# EAGLE design sensor (EAGLE 5.10)
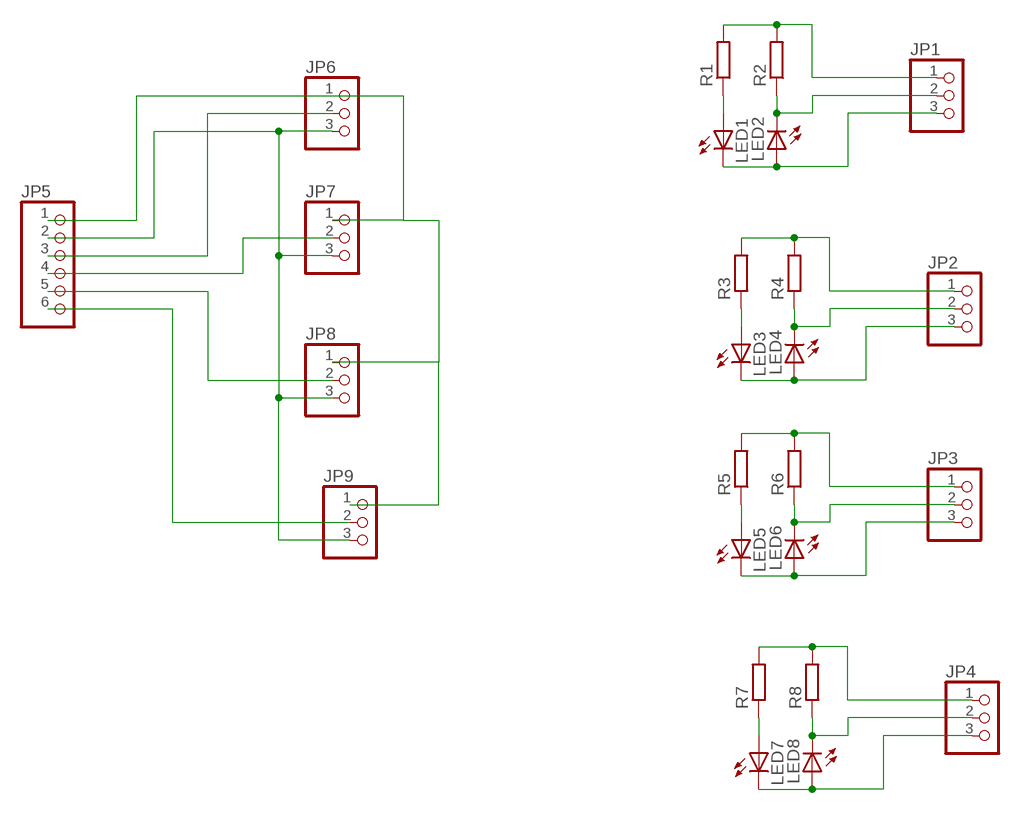
[diagram p0: schematic, sheet 1]

## Parts
JP1  PINHD-1X3  [1X03]
JP2  PINHD-1X3  [1X03]
JP3  PINHD-1X3  [1X03]
JP4  PINHD-1X3  [1X03]
JP5  PINHD-1X6  [1X06]
JP6  PINHD-1X3  [1X03]
JP7  PINHD-1X3  [1X03]
JP8  PINHD-1X3  [1X03]
JP9  PINHD-1X3  [1X03]
LED1  LED5MM  [LED5MM]
LED2  LED5MM  [LED5MM]
LED3  LED5MM  [LED5MM]
LED4  LED5MM  [LED5MM]
LED5  LED5MM  [LED5MM]
LED6  LED5MM  [LED5MM]
LED7  LED5MM  [LED5MM]
LED8  LED5MM  [LED5MM]
R1  R-EU_0204/7  [0204/7]
R2  R-EU_0204/7  [0204/7]
R3  R-EU_0204/7  [0204/7]
R4  R-EU_0204/7  [0204/7]
R5  R-EU_0204/7  [0204/7]
R6  R-EU_0204/7  [0204/7]
R7  R-EU_0204/7  [0204/7]
R8  R-EU_0204/7  [0204/7]

## Nets
N$1: JP1.1 R1.2 R2.2
N$2: JP1.3 LED1.K(C) LED2.A
N$3: JP1.2 LED2.K(C) R2.1
N$4: LED1.A R1.1
N$5: JP2.1 R3.2 R4.2
N$6: JP2.3 LED3.K(C) LED4.A
N$7: JP2.2 LED4.K(C) R4.1
N$8: LED3.A R3.1
N$9: JP3.1 R5.2 R6.2
N$10: JP3.3 LED5.K(C) LED6.A
N$11: JP3.2 LED6.K(C) R6.1
N$12: LED5.A R5.1
N$13: JP4.1 R7.2 R8.2
N$14: JP4.3 LED7.K(C) LED8.A
N$15: JP4.2 LED8.K(C) R8.1
N$16: LED7.A R7.1
N$17: JP5.1 JP6.1 JP7.1 JP8.1 JP9.1
N$19: JP5.2 JP6.3 JP7.3 JP8.3 JP9.3
N$22: JP5.3 JP6.2
N$23: JP5.4 JP7.2
N$24: JP5.5 JP8.2
N$25: JP5.6 JP9.2

## Library data of the parts
JP1-JP4 JP6-JP9 = pinhead:PINHD-1X3: PIN HEADER
JP5 = pinhead:PINHD-1X6: PIN HEADER
LED1-LED8 = led:LED: LED OSRAM: - CHIPLED LG R971, LG N971, LY N971, LG Q971, LY Q971, LO R971, LY R971 LH N974, LH R974 LS Q976, LO Q976, LY Q976 LO Q996 - Hyper CHIPLED LW Q18S LB Q993, LB Q99A, LB R99A - SideLED LS A670, LO A670, LY A670, LG A670, LP A670 LB A673, LV A673, LT A673, LW A673 LH A674 LY A675 LS A676, LA A676, LO A676, LY A676, LW A676 LS A679, LY A679, LG A679 - Hyper Micro SIDELED® LS Y876, LA Y876, LO Y876, LY Y876 LT Y87S - SmartLED LW L88C, LW L88S LB L89C, LB L89S, LG L890 LS L89K, LO L89K, LY L89K LS L896, LA L896, LO L896, LY L896 - TOPLED LS T670, LO T670, LY T670, LG T670, LP T670 LSG T670, LSP T670, LSY T670, LOP T670, LYG T670 LG T671, LOG T671, LSG T671 LB T673, LV T673, LT T673, LW T673 LH T674 LS T676, LA T676, LO T676, LY T676, LB T676, LH T676, LSB T676, LW T676 LB T67C, LV T67C, LT T67C, LS T67K, LO T67K, LY T67K, LW E67C LS E67B, LA E67B, LO E67B, LY E67B, LB E67C, LV E67C, LT E67C LW T67C LS T679, LY T679, LG T679 LS T770, LO T770, LY T770, LG T770, LP T770 LB T773, LV T773, LT T773, LW T773 LH T774 LS E675, LA E675, LY E675, LS T675 LS T776, LA T776, LO T776, LY T776, LB T776 LHGB T686 LT T68C, LB T68C - Hyper Mini TOPLED® LB M676 - Mini TOPLED Santana® LG M470 LS M47K, LO M47K, LY M47K Source: http://www.osram.convergy.de LUXEON: - LUMILED® LXK2-PW12-R00, LXK2-PW12-S00, LXK2-PW14-U00, LXK2-PW14-V00 LXK2-PM12-R00, LXK2-PM12-S00, LXK2-PM14-U00 LXK2-PE12-Q00, LXK2-PE12-R00, LXK2-PE12-S00, LXK2-PE14-T00, LXK2-PE14-U00 LXK2-PB12-K00, LXK2-PB12-L00, LXK2-PB12-M00, LXK2-PB14-N00, LXK2-PB14-P00, LXK2-PB14-Q00 LXK2-PR12-L00, LXK2-PR12-M00, LXK2-PR14-Q00, LXK2-PR14-R00 LXK2-PD12-Q00, LXK2-PD12-R00, LXK2-PD12-S00 LXK2-PH12-R00, LXK2-PH12-S00 LXK2-PL12-P00, LXK2-PL12-Q00, LXK2-PL12-R00 Source: www.luxeon.com KINGBRIGHT: KA-3528ASYC Source: www.kingbright.com
R1-R8 = rcl:R-EU_: RESISTOR, European symbol

## Board
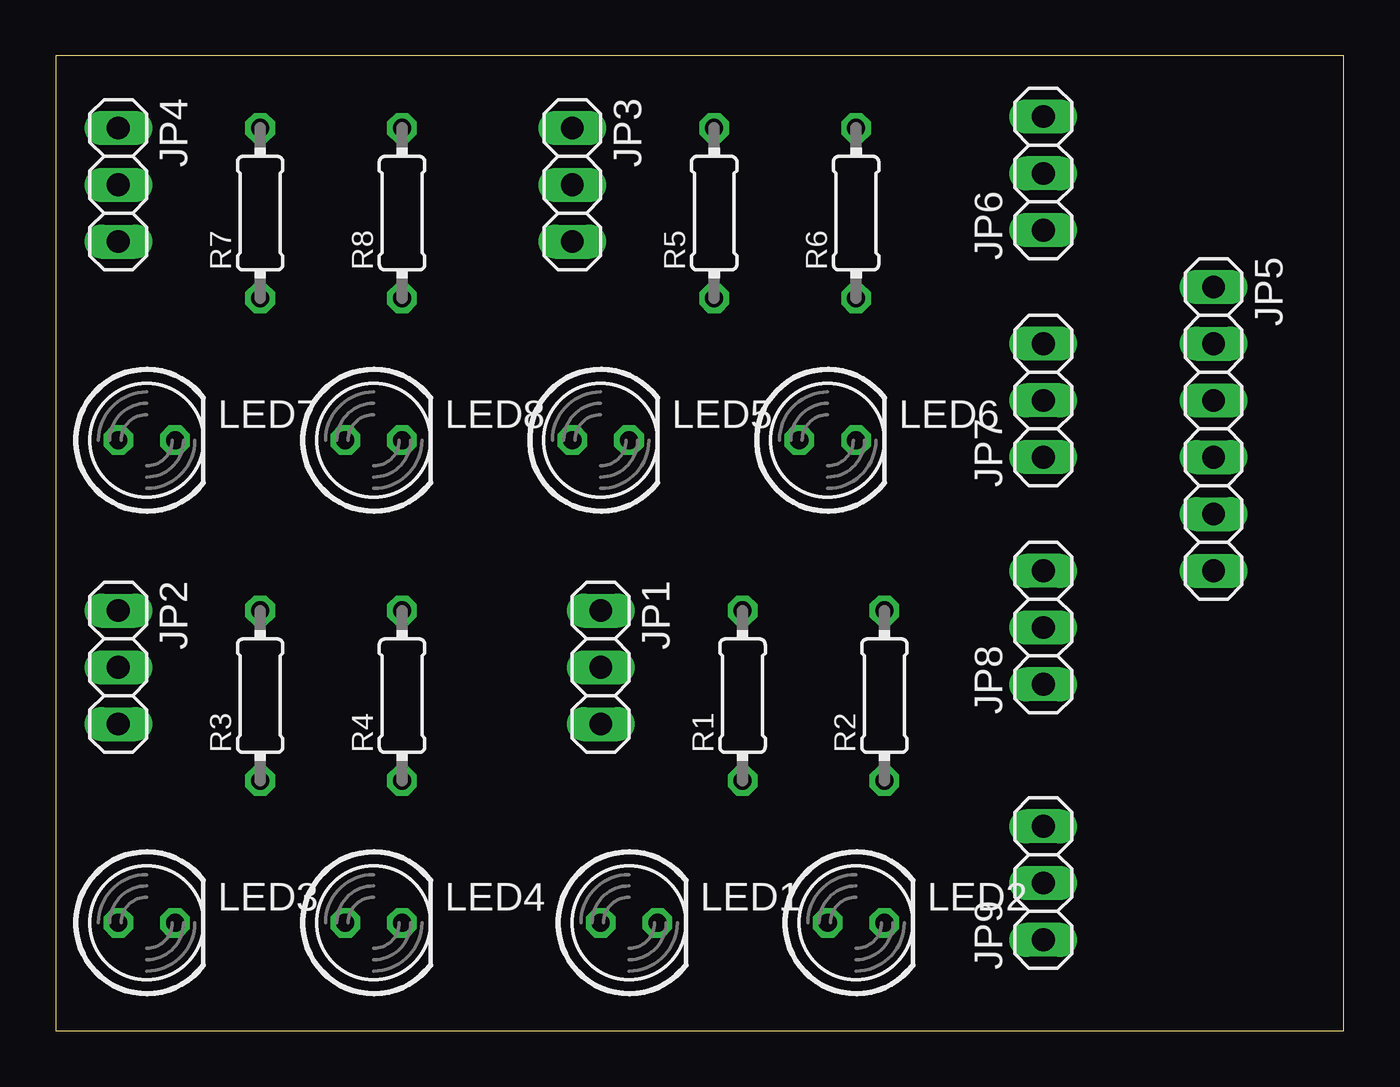
[diagram p1: board, top side]
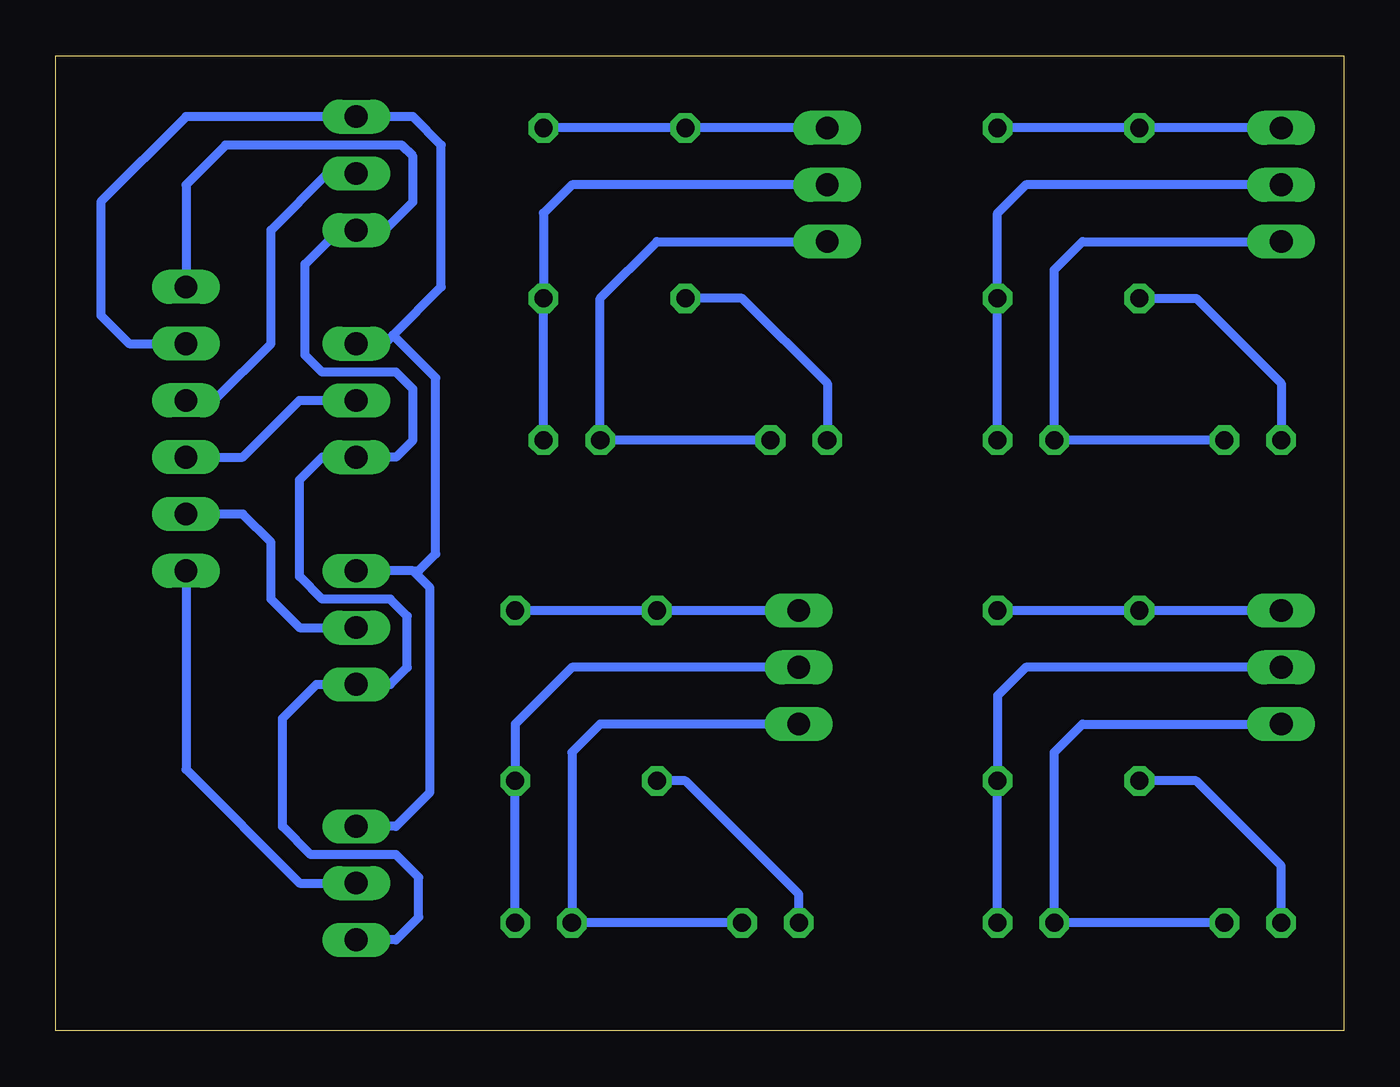
[diagram p2: board, bottom side, seen from below]

Size 57.64 x 43.61 mm. Coordinates in mm from the lower left corner, seen from the top.
Outline: 0,0 57.64,0 57.64,43.61 0,43.61 0,0
Copper layers (1*16): Top 0.035mm / dielectric 1.5mm / Bottom 0.035mm
Design rules "default": minimum track width 10mil, minimum drill 24mil, track to track 8mil, track to pad 8mil, pad to pad 8mil, via to via 8mil, smd to smd 8mil, copper to edge 40mil, drill to drill 8mil, minimum pad ring 10mil, minimum via ring 8mil, stop-mask expansion 4mil, vias tented up to drill 0mil, thermal gap 10mil

### Footprints (pad centres in the part's own frame; a part is rotated, then mirrored left to right if it is on the bottom)
1X03 = drill 1.016 long: 1 -2.54,0; 2 0,0; 3 2.54,0
1X06 = drill 1.016 long: 1 -6.35,0; 2 -3.81,0; 3 -1.27,0; 4 1.27,0; 5 3.81,0; 6 6.35,0
LED5MM = drill 0.813 octagon: A -1.27,0; K 1.27,0
0204/7 = drill 0.813 octagon: 1 -3.81,0; 2 3.81,0

### Placement (x,y rotation side)
JP1  24.38,16.26 270 top
JP2  2.79,16.26 270 top
JP3  23.11,37.85 270 top
JP4  2.79,37.85 270 top
JP5  51.82,26.92 270 top
JP6  44.2,38.35 90 top
JP7  44.2,28.19 90 top
JP8  44.2,18.03 90 top
JP9  44.2,6.6 90 top
LED1  25.65,4.83 0 top
LED2  35.81,4.83 0 top
LED3  4.06,4.83 0 top
LED4  14.22,4.83 0 top
LED5  24.38,26.42 0 top
LED6  34.54,26.42 0 top
LED7  4.06,26.42 0 top
LED8  14.22,26.42 0 top
R1  30.73,14.99 90 top
R2  37.08,14.99 90 top
R3  9.14,14.99 90 top
R4  15.49,14.99 90 top
R5  29.46,36.58 90 top
R6  35.81,36.58 90 top
R7  9.14,36.58 90 top
R8  15.49,36.58 90 top

### Tracks (layer width: path | path; a pad name or v marks a point on that pad's centre or on a via)
N$1
  Bottom 0.406: JP1.1 R1.2 R2.2
N$2
  Bottom 0.406: LED1.K LED2.A 34.54,12.45 33.27,13.72 JP1.3
N$3
  Bottom 0.406: LED2.K R2.1 37.08,13.72 34.54,16.26 JP1.2
N$4
  Bottom 0.406: LED1.A 24.38,6.1 29.46,11.18 R1.1
N$5
  Bottom 0.406: JP2.1 R3.2 R4.2
N$6
  Bottom 0.406: LED3.K LED4.A 12.95,12.45 11.68,13.72 JP2.3
N$7
  Bottom 0.406: LED4.K R4.1 15.49,14.99 14.22,16.26 JP2.2
N$8
  Bottom 0.406: LED3.A 2.79,7.37 6.6,11.18 R3.1
N$9
  Bottom 0.406: JP3.1 R5.2 R6.2
N$10
  Bottom 0.406: LED5.K LED6.A 33.27,32.77 30.73,35.31 JP3.3
N$11
  Bottom 0.406: LED6.K R6.1 35.81,36.58 34.54,37.85 JP3.2
N$12
  Bottom 0.406: R5.1 26.92,32.77 23.11,28.96 LED5.A
N$13
  Bottom 0.406: R8.2 R7.2 JP4.1
N$14
  Bottom 0.406: LED7.K LED8.A 12.95,34.04 11.68,35.31 JP4.3
N$15
  Bottom 0.406: LED8.K R8.1 15.49,36.58 14.22,37.85 JP4.2
N$16
  Bottom 0.406: R7.1 6.6,32.77 2.79,28.96 LED7.A
N$17
  Bottom 0.406: JP5.1 51.82,37.85 50.04,39.62 42.16,39.62 41.66,39.12 41.66,37.08 42.93,35.81 JP6.1 44.96,35.81 46.48,34.29 46.48,30.23 45.72,29.46 42.42,29.46 41.66,28.7 41.66,26.42 42.42,25.65 JP7.1 45.72,25.65 46.74,24.64 46.74,20.32 45.72,19.3 42.67,19.3 41.91,18.54 41.91,16.26 42.67,15.49 JP8.1 45.97,15.49 47.5,13.97 47.5,9.14 46.23,7.87 42.42,7.87 41.4,6.86 41.4,5.08 42.42,4.06 JP9.1
N$19
  Bottom 0.406: JP5.2 54.36,30.73 55.63,32 55.63,37.08 51.82,40.89 JP6.3 41.66,40.89 40.39,39.62 40.39,33.27 42.55,31.12 | 42.55,31.12 42.93,30.73 JP7.3 | 41.66,20.57 41.4,20.57 40.64,21.34 40.64,29.21 42.55,31.12 | 41.66,20.57 JP8.3 | JP9.3 42.42,9.14 40.89,10.67 40.89,19.81 41.66,20.57
N$22
  Bottom 0.406: JP5.3 50.55,28.19 48.01,30.73 48.01,35.81 45.47,38.35 JP6.2
N$23
  Bottom 0.406: JP5.4 49.28,25.65 46.74,28.19 JP7.2
N$24
  Bottom 0.406: JP5.5 49.28,23.11 48.01,21.84 48.01,19.3 46.74,18.03 JP8.2
N$25
  Bottom 0.406: JP5.6 51.82,11.68 46.74,6.6 JP9.2